# Altium project UG3_Motor_Driver.PrjPcb
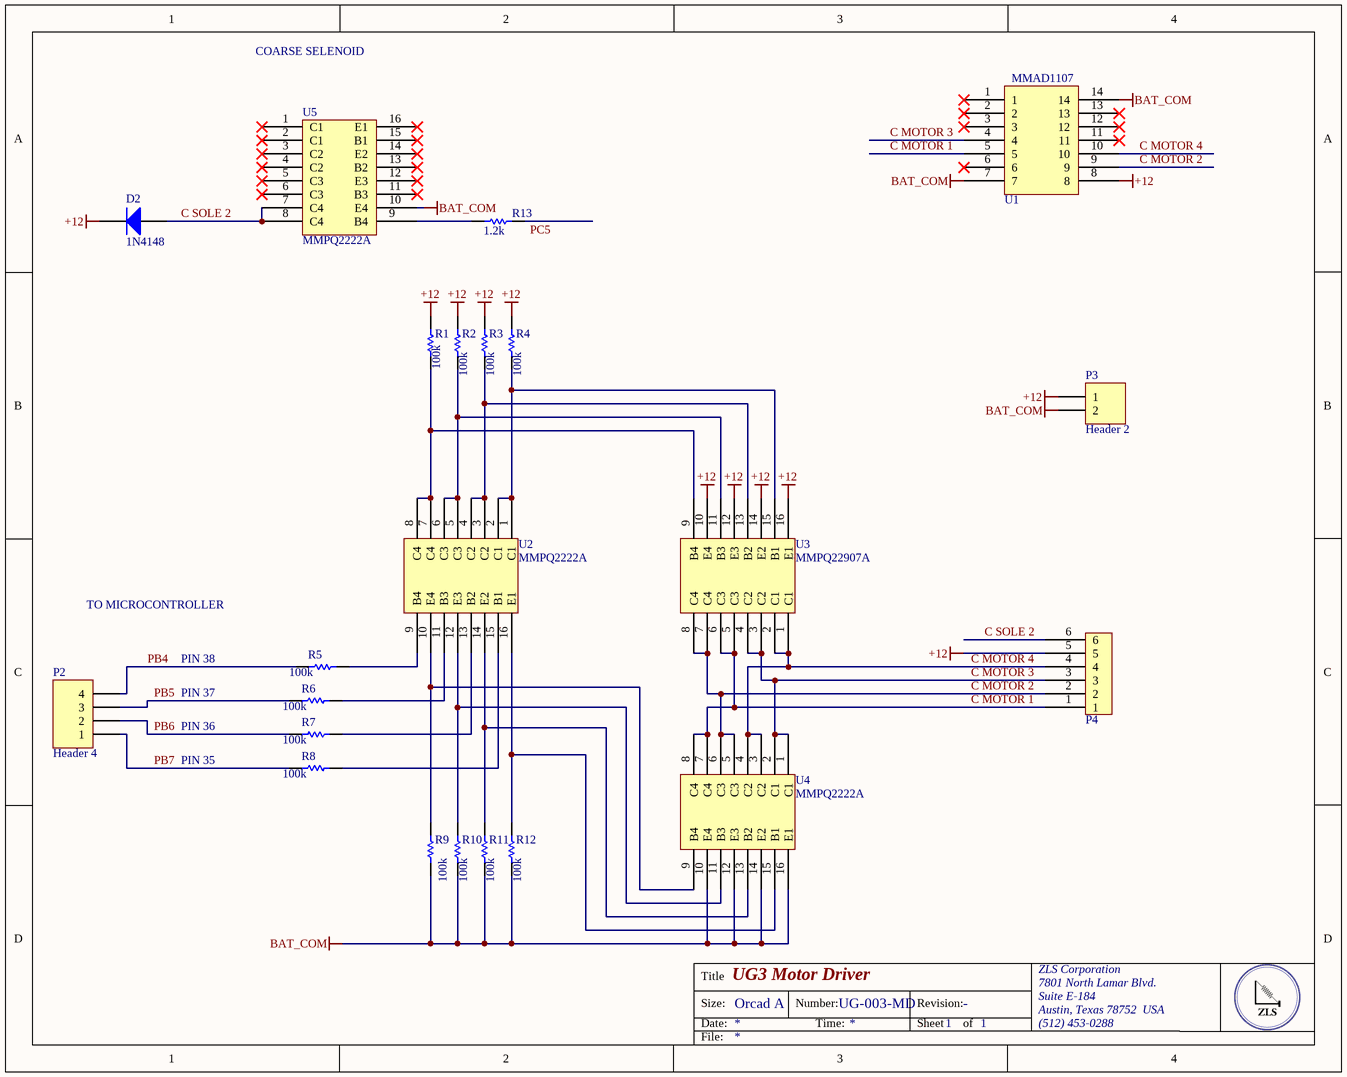
[diagram p0: Sheet1.SchDoc]
1 sheet, 22 parts. Net scope: global (net labels, ports and power ports of the same name join across sheets).
Board file: PCB2.PcbDoc

## Sheet Sheet1.SchDoc: UG3 Motor Driver
size OrCAD A; DocumentNumber: UG-003-MD; Revision: -; SheetNumber: 1; SheetTotal: 1; DocumentName: UG3 Motor Driver

### Parts
D2  1N4148  [NXP-SOD27-2_V]
P2  Header 4  [HDR1X4]
P3  Header 2  [HDR1X2]
P4  JF-6  [JF-6]  (value not drawn)
R1  100k  [RESC0805(2012)_L]
R2  100k  [RESC0805(2012)_L]
R3  100k  [RESC0805(2012)_L]
R4  100k  [RESC0805(2012)_L]
R5  100k  [RESC0805(2012)_L]
R6  100k  [RESC0805(2012)_L]
R7  100k  [RESC0805(2012)_L]
R8  100k  [RESC0805(2012)_L]
R9  100k  [RESC0805(2012)_L]
R10  100k  [RESC0805(2012)_L]
R11  100k  [RESC0805(2012)_L]
R12  100k  [RESC0805(2012)_L]
R13  1.2k  [RESC0805(2012)_L]
U1  MMAD1107  [MMAD1107]
U2  MMPQ2222A  [MMPQ2222A]
U3  MMPQ22907A  [MMPQ22907A]
U4  MMPQ2222A  [MMPQ2222A]
U5  MMPQ2222A  [MMPQ2222A]

### Nets
+12: D2.2(K) P3.1 P4.5 R1.1 R2.1 R3.1 R4.1 U1.8 U3.10(E4) U3.12(E3) U3.14(E2) U3.16(E1)
BAT_COM: P3.2 R9.1 R10.1 R11.1 R12.1 U1.7 U1.14 U4.10(E4) U4.12(E3) U4.14(E2) U4.16(E1) U5.10(E4)
C MOTOR 1: P4.1 U1.5 U3.5(C3) U3.6(C3) U4.7(C4) U4.8(C4)
C MOTOR 2: P4.2 U1.9 U3.7(C4) U3.8(C4) U4.5(C3) U4.6(C3)
C MOTOR 3: P4.3 U1.4 U3.3(C2) U3.4(C2) U4.1(C1) U4.2(C1)
C MOTOR 4: P4.4 U1.10 U3.1(C1) U3.2(C1) U4.3(C2) U4.4(C2)
C SOLE 2: D2.1(A) P4.6 U5.7(C4) U5.8(C4)
PB4: P2.4 R5.2
PB5: P2.3 R6.2
PB6: P2.2 R7.2
PB7: P2.1 R8.2
PC5: R13.2
NetR1_2: R1.2 U2.7(C4) U2.8(C4) U3.9(B4)
NetR2_2: R2.2 U2.5(C3) U2.6(C3) U3.11(B3)
NetR3_2: R3.2 U2.3(C2) U2.4(C2) U3.13(B2)
NetR4_2: R4.2 U2.1(C1) U2.2(C1) U3.15(B1)
NetR5_1: R5.1 U2.9(B4)
NetR6_1: R6.1 U2.11(B3)
NetR7_1: R7.1 U2.13(B2)
NetR8_1: R8.1 U2.15(B1)
NetR9_2: R9.2 U2.10(E4) U4.9(B4)
NetR10_2: R10.2 U2.12(E3) U4.11(B3)
NetR11_2: R11.2 U2.14(E2) U4.13(B2)
NetR12_2: R12.2 U2.16(E1) U4.15(B1)
NetR13_1: R13.1 U5.9(B4)

Not connected (* = marked no-connect by the designer): U1 1* 2* 3* 6* 11* 12* 13*; U5 1(C1)* 2(C1)* 3(C2)* 4(C2)* 5(C3)* 6(C3)* 11(B3)* 12(E3)* 13(B2)* 14(E2)* 15(B1)* 16(E1)*

### Notes on the sheet
- COARSE SELENOID
- TO MICROCONTROLLER
- PIN 38
- PIN 37
- PIN 36
- PIN 35
- Title
- Size:
- Date:
- Orcad A
- Number:
- Time:
- Revision:
- Sheet
- of
- ZLS Corporation
- 7801 North Lamar Blvd.
- Suite E-184
- Austin, Texas 78752  USA
- (512) 453-0288
- File:

### Library data of the parts
D2 = CMP-0648-00002-1: High-speed Diode, 100 V, 450 mA, 2-Pin SOD27, RoHS; Manufacturer: NXP Semiconductors; Configuration: Single; IR (VR: 20 V)=25 nA; IFRM: 450 mA; IFSM: 4 A Max.; Trr: 4 ns Max.; Cd: 4 pF Max.; VR: 100 V Max.; VF (IF: 10 mA)=1 V; IF: 200 mA Max.; ComponentLink1Description: Manufacturer URL; RoHS: TRUE; ComponentLink1URL: http://www.nxp.com/; ComponentLink3Description: Package Specification; DatasheetVersion: Aug-04; ComponentLink2Description: Datasheet; PackageVersion: Aug-04; PackageReference: SOD27; ComponentLink3URL: http://www.nxp.com/documents/data_sheet/1N4148_1N4448.pdf; Mounting Technology: Through Hole; ComponentLink2URL: http://www.nxp.com/documents/data_sheet/1N4148_1N4448.pdf; PartNumber: 1N4148; PackageDescription: 2-Pin Hermetically Sealed Glass Package, Axial Leaded, Dia 1.85 mm, Body Length 4.25 mm, Lead Spread 25.4 mm
P2 = Header 4: Header, 4-Pin; LatestRevisionDate: 17-Jul-2002; LatestRevisionNote: Re-released for DXP Platform.; Publisher: Altium Limited
P3 = Header 2: Header, 2-Pin; LatestRevisionDate: 17-Jul-2002; LatestRevisionNote: Re-released for DXP Platform.; Publisher: Altium Limited
R1-R12 = CMP-1013-00215-1: 2R55 0.125W 1% 0805 (2012 Metric)  SMD; Case-Metric: 2012; Case-EIA: 0805; Value: 100k; Tolerance: 1 %; Technology: SMT; Power: 0.125 W
R13 = CMP-1013-00215-1: 2R55 0.125W 1% 0805 (2012 Metric)  SMD; Case-Metric: 2012; Value: 100k; Case-EIA: 0805; Tolerance: 1 %; Technology: SMT; Power: 0.125 W